# EAGLE design RTC (EAGLE 7.3.0)
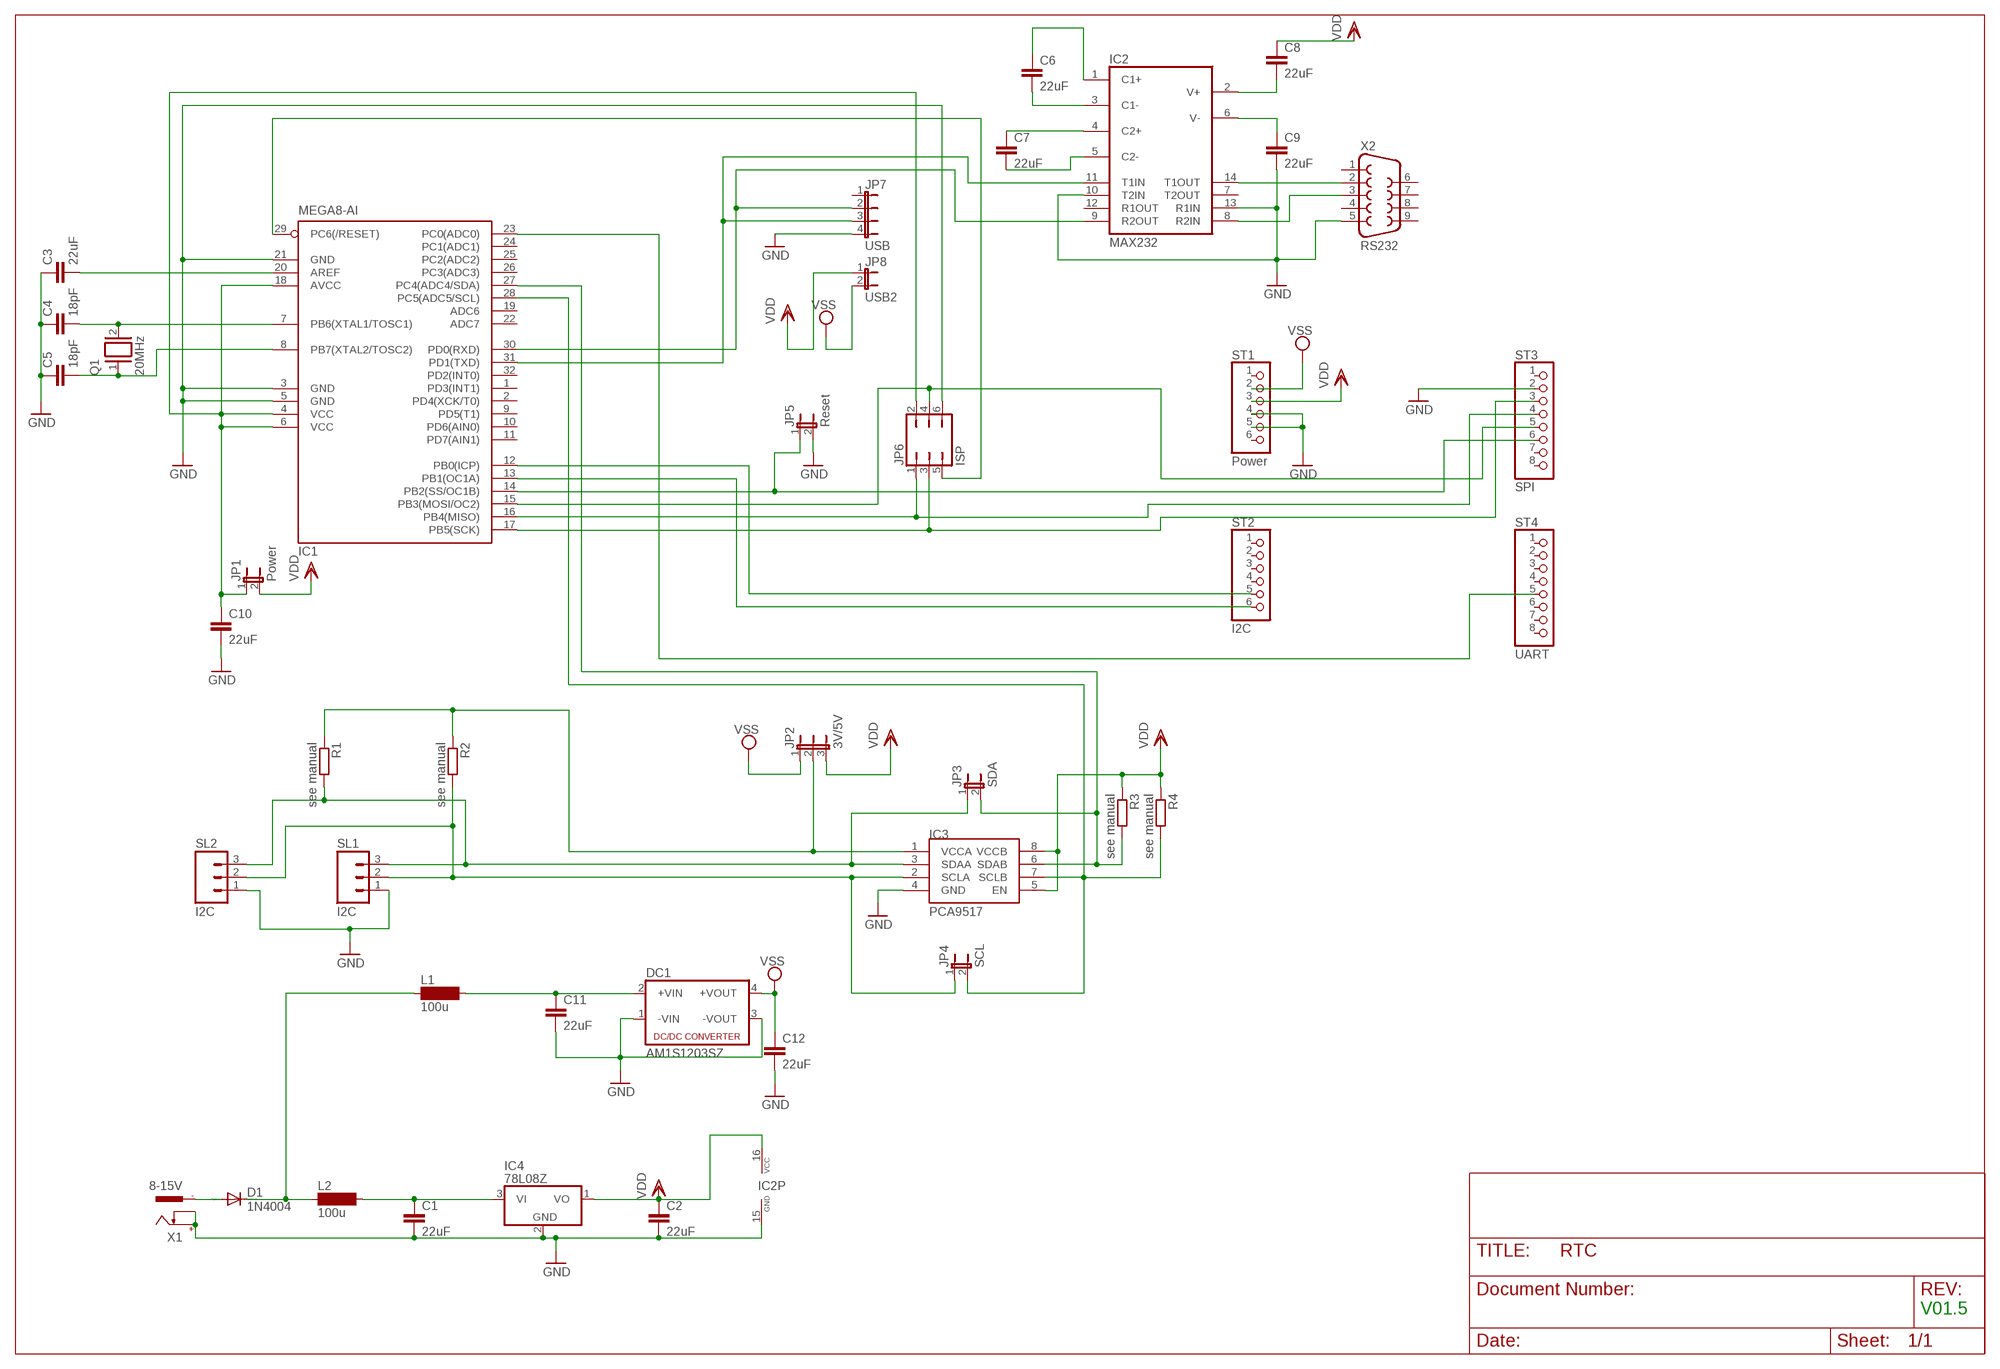
[diagram p0: schematic, sheet 1]

## Parts
C1  22uF  C-EUC1206  [C1206]
C2  22uF  C-EUC1206  [C1206]
C3  22uF  C-EUC1206  [C1206]
C4  18pF  C-EU025-025X050  [C025-025X050]
C5  18pF  C-EU025-025X050  [C025-025X050]
C6  22uF  C-EUC1206  [C1206]
C7  22uF  C-EUC1206  [C1206]
C8  22uF  C-EUC1206  [C1206]
C9  22uF  C-EUC1206  [C1206]
C10  22uF  C-EUC1206  [C1206]
C11  22uF  C-EUC1206  [C1206]
C12  22uF  C-EUC1206  [C1206]
D1  1N4004  [DO41-10]
DC1  AM1S1203SZ  NME  [NME]
IC1  MEGA8-AI  [TQFP32-08]
IC2  MAX232  [DIL16]
IC3  PCA9517  [SO-08]
IC4  78L08Z  [TO92]
JP1  Power  JP1E  [JP1]
JP2  3V/5V  JP2E  [JP2]
JP3  SDA  JP1E  [JP1]
JP4  SCL  JP1E  [JP1]
JP5  Reset  JP1E  [JP1]
JP6  ISP  JP3Q  [JP3Q]
JP7  USB  JP4E  [JP4]
JP8  USB2  JP1E  [JP1]
L1  100u  MS85  [MS85]
L2  100u  MS85  [MS85]
Q1  20MHz  XTAL/S  [QS]
R1  see manual  R-EU_R1206  [R1206]
R2  see manual  R-EU_R1206  [R1206]
R3  see manual  R-EU_R1206  [R1206]
R4  see manual  R-EU_R1206  [R1206]
SL1  I2C  M03  [03P]
SL2  I2C  M03  [03P]
ST1  Power  PINHD-1X6  [1X06]
ST2  I2C  PINHD-1X6  [1X06]
ST3  SPI  PINHD-1X8  [1X08]
ST4  UART  PINHD-1X8  [1X08]
X1  8-15V  737992-55  [737992-5]
X2  RS232  F09H  [F09H]

## Nets
GND: C1.2 C2.2 C3.1 C4.1 C5.1 C9.2 C10.2 C11.2 C12.2 DC1.1(-VIN) DC1.3(-VOUT) IC1.3(GND) IC1.5(GND) IC1.21(GND) IC2.10(T2IN) IC2.13(R1IN) IC2.15(GND) IC3.4(GND) IC4.2(GND) JP5.2 JP6.6 JP7.4 SL1.1 SL2.1 ST1.4 ST1.5 ST3.2 X1.+ X1.K X2.5
N$1: IC1.23(PC0(ADC0)) ST4.5
N$2: IC1.12(PB0(ICP)) ST2.5
N$3: C11.1 DC1.2(+VIN) L1.2
N$4: IC1.14(PB2(SS/OC1B)) JP5.1 ST3.6
N$5: IC1.27(PC4(ADC4/SDA)) IC3.6(SDAB) JP3.2 R3.2
N$6: IC2.8(R2IN) X2.3
N$7: D1.C L1.1 L2.1
N$8: IC1.31(PD1(TXD)) IC2.11(T1IN) JP7.3
N$9: IC1.30(PD0(RXD)) IC2.9(R2OUT) JP7.2
N$10: IC1.13(PB1(OC1A)) ST2.6
N$11: IC3.2(SCLA) JP4.1 R2.2 SL1.2 SL2.2
N$12: IC3.3(SDAA) JP3.1 R1.2 SL1.3 SL2.3
N$13: IC2.14(T1OUT) X2.2
N$14: C8.2 IC2.2(V+)
N$15: IC1.16(PB4(MISO)) JP6.1 ST3.4
N$16: C9.1 IC2.6(V-)
N$18: IC1.29(PC6(/RESET)) JP6.5
N$19: C4.2 IC1.7(PB6(XTAL1/TOSC1)) Q1.2
N$20: IC1.17(PB5(SCK)) JP6.3 ST3.3
N$21: IC3.1(VCCA) JP2.2 R1.1 R2.1
N$22: IC1.28(PC5(ADC5/SCL)) IC3.7(SCLB) JP4.2 R4.2
N$23: C6.1 IC2.1(C1+)
N$24: C6.2 IC2.3(C1-)
N$25: C7.1 IC2.4(C2+)
N$26: C7.2 IC2.5(C2-)
N$27: D1.A X1.-1
N$28: IC1.15(PB3(MOSI/OC2)) JP6.4 ST3.5
N$33: C1.1 IC4.3(VI) L2.2
N$35: C3.2 IC1.20(AREF)
N$37: C5.2 IC1.8(PB7(XTAL2/TOSC2)) Q1.1
N$44: C10.1 IC1.4(VCC) IC1.6(VCC) IC1.18(AVCC) JP1.1 JP6.2
VDD: C2.1 C8.1 IC2.16(VCC) IC3.5(EN) IC3.8(VCCB) IC4.1(VO) JP1.2 JP2.3 JP8.1 R3.1 R4.1 ST1.3
VSS: C12.1 DC1.4(+VOUT) JP2.1 JP8.2 ST1.2
Unconnected: IC1.1(PD3(INT1)) IC1.2(PD4(XCK/T0)) IC1.9(PD5(T1)) IC1.10(PD6(AIN0)) IC1.11(PD7(AIN1)) IC1.19(ADC6) IC1.22(ADC7) IC1.24(PC1(ADC1)) IC1.25(PC2(ADC2)) IC1.26(PC3(ADC3)) IC1.32(PD2(INT0)) IC2.7(T2OUT) IC2.12(R1OUT) JP7.1 ST1.1 ST1.6 ST2.1 ST2.2 ST2.3 ST2.4 ST3.1 ST3.7 ST3.8 ST4.1 ST4.2 ST4.3 ST4.4 ST4.6 ST4.7 ST4.8 X1.-2 X2.1 X2.4 X2.6 X2.7 X2.8 X2.9

## Notes on the sheet
- V01.5

## Library data of the parts
C1-C3 C6-C12 = rcl:C-EU: CAPACITOR, European symbol
C4 C5 = resistor:C-EU: CAPACITOR, European symbol
D1 = diode:1N4004: DIODE general purpose rectifier, 1 A
DC1 = dc-dc-converter:NME: DC-DC CONVERTER; MF: C & D TECHNOLOGIES, INC; MPN: NME1205D; OC_FARNELL: 1021466; OC_NEWARK: 98B8198
IC1 = atmel:MEGA8: MICROCONTROLLER 8 Kbytes FLASH, 1 kbytes SRAM, 512 bytes EEPROM, USART, 6-channel 10 bit ADC, 2-channel 8 bit ADC Pin compatible with Atmega48, ATMega88, ATMega168 Source: avr.lbr; MPN: ATMEGA8-16AU; OC_FARNELL: 9171371; OC_NEWARK: 73M8863
IC2 = maxim:MAX232: RS232 TRANSCEIVER; MF: MAXIM; MPN: MAX232ACPE+; OC_FARNELL: 9723773; OC_NEWARK: 68K4544
IC3 = PCA9517:PCA9517: PCA9517
IC4 = linear:78*: Positive VOLTAGE REGULATOR Source: http://cache.national.com/ds/LM/LM78L05.pdf http://www.fairchildsemi.com/ds/LM/LM7805.pdf
JP1 JP3-JP5 JP8 = jumper:JP1E: JUMPER
JP2 = jumper:JP2E: JUMPER
JP6 = jumper:JP3Q: JUMPER
JP7 = jumper:JP4E: JUMPER
L1 L2 = inductor-neosid:MS85: INDUCTOR SMD power inductor; OC_FARNELL: unknown; OC_NEWARK: unknown
Q1 = special:XTAL/S: CRYSTAL
R1-R4 = resistor:R-EU_: RESISTOR, European symbol
SL1 SL2 = con-amp-quick:M03: AMP QUICK CONNECTOR; OC_FARNELL: unknown; OC_NEWARK: unknown
ST1 ST2 = pinhead:PINHD-1X6: PIN HEADER
ST3 ST4 = pinhead:PINHD-1X8: PIN HEADER
X1 = con-conrad:737992-55: FEMALE PRINT CONNECTOR DIN 45323 (34V/3A), ROKA, distributor Conrad
X2 = con-subd:F09: SUB-D; OC_FARNELL: unknown; OC_NEWARK: unknown

## Board
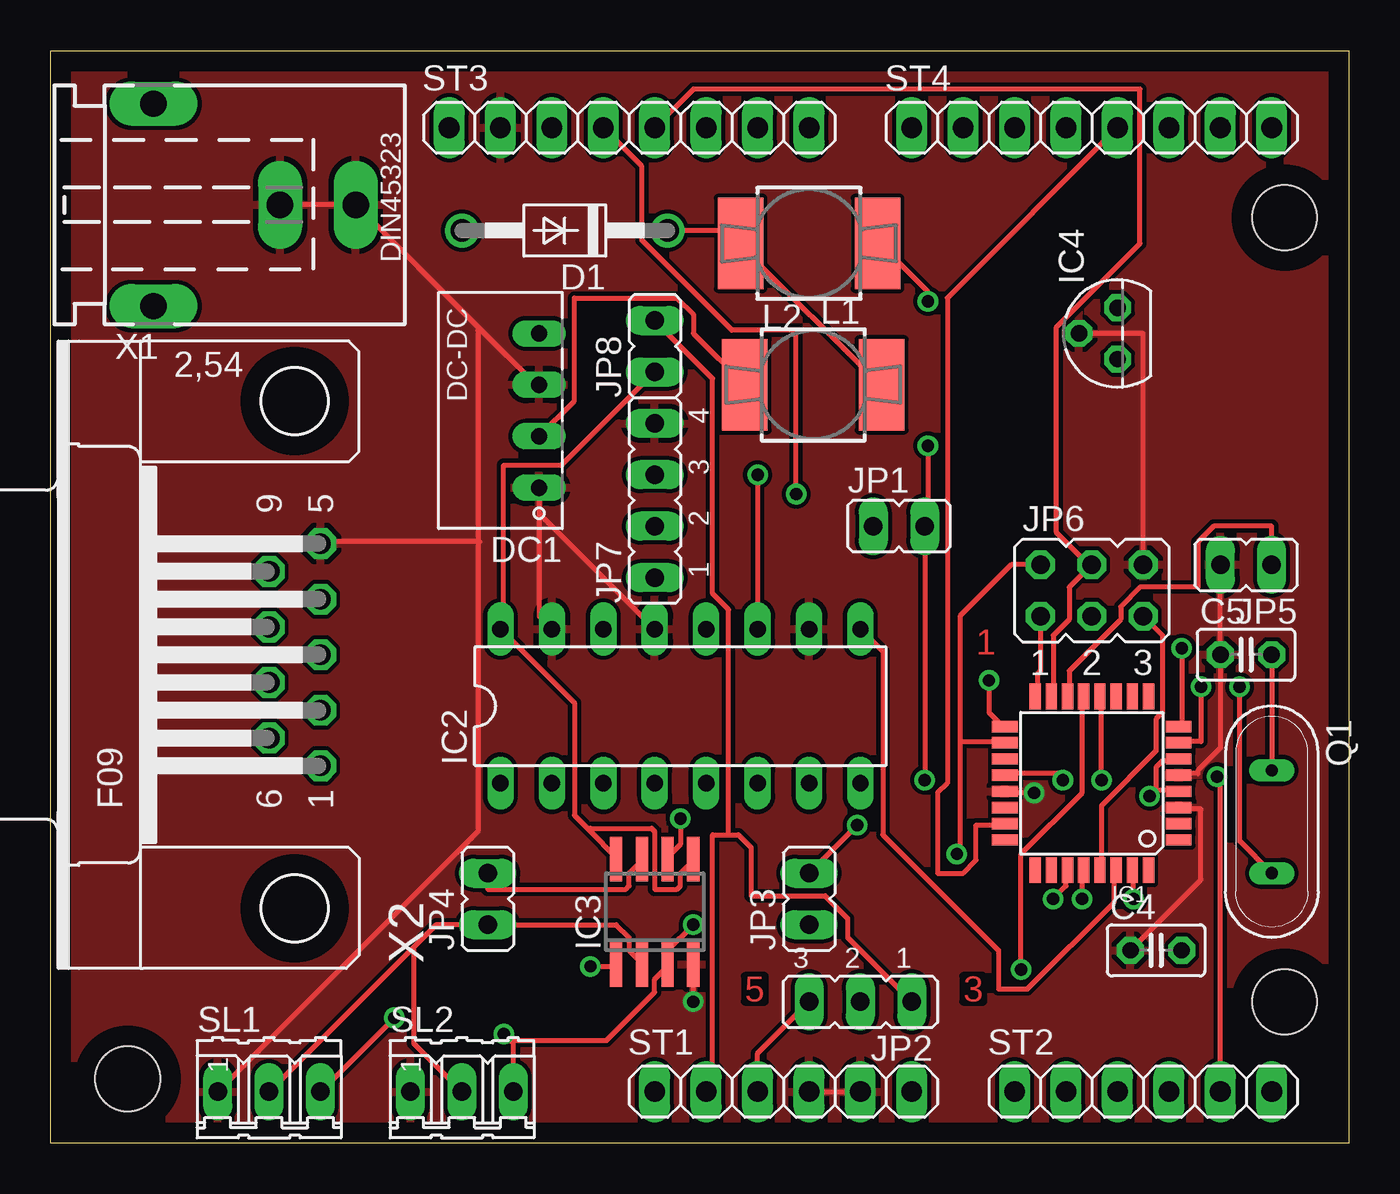
[diagram p1: board, top side]
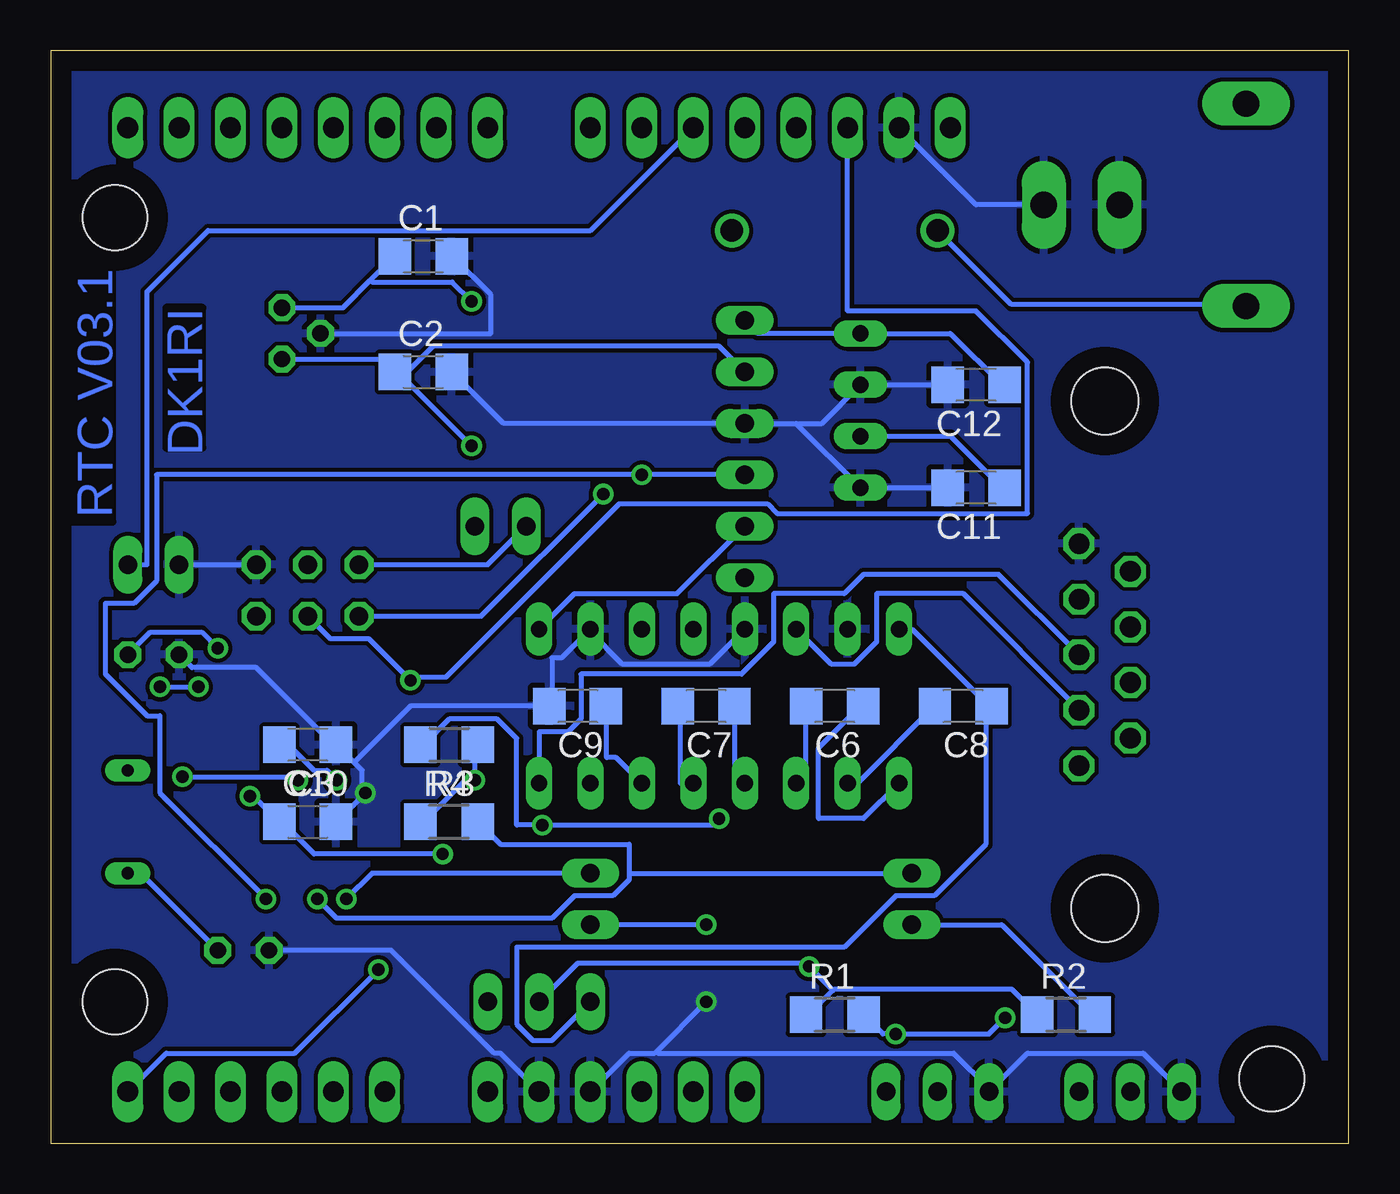
[diagram p2: board, bottom side, seen from below]

Size 64.14 x 53.98 mm. Coordinates in mm from the lower left corner, seen from the top.
Outline: 0,0 0,53.98 64.14,53.98 64.14,0 0,0
Copper layers (1*16): Top 0.035mm / dielectric 1.5mm / Bottom 0.035mm
Design rules "default": minimum track width 10mil, minimum drill 24mil, track to track 8mil, track to pad 8mil, pad to pad 8mil, via to via 8mil, smd to smd 8mil, copper to edge 40mil, drill to drill 8mil, minimum pad ring 10mil, minimum via ring 8mil, stop-mask expansion 4mil, vias tented up to drill 0mil, thermal gap 10mil
Holes 3.2 mm at 60.96,45.72 60.96,6.99 3.81,3.17

### Footprints (pad centres in the part's own frame; a part is rotated, then mirrored left to right if it is on the bottom)
C1206 = smd 1.6 x 1.8: 1 -1.4,0; 2 1.4,0
C025-025X050 = drill 0.813 octagon: 1 -1.27,0; 2 1.27,0
DO41-10 = drill 1.118: A 5.08,0; C -5.08,0
NME = drill 0.813 long: 1 0,3.81; 2 0,1.27; 3 0,-1.27; 4 0,-3.81
TQFP32-08 = smd 1.27 x 0.559: 1 -4.293,2.8; 2 -4.293,2; 3 -4.293,1.2; 4 -4.293,0.4; 5 -4.293,-0.4; 6 -4.293,-1.2; 7 -4.293,-2; 8 -4.293,-2.8; 17 4.293,-2.8; 18 4.293,-2; 19 4.293,-1.2; 20 4.293,-0.4; 21 4.293,0.4; 22 4.293,1.2; 23 4.293,2; 24 4.293,2.8 | smd 0.559 x 1.27: 9 -2.8,-4.293; 10 -2,-4.293; 11 -1.2,-4.293; 12 -0.4,-4.293; 13 0.4,-4.293; 14 1.2,-4.293; 15 2,-4.293; 16 2.8,-4.293; 25 2.8,4.293; 26 2,4.293; 27 1.2,4.293; 28 0.4,4.293; 29 -0.4,4.293; 30 -1.2,4.293; 31 -2,4.293; 32 -2.8,4.293
DIL16 = drill 0.813 long: 1 -8.89,-3.81; 2 -6.35,-3.81; 3 -3.81,-3.81; 4 -1.27,-3.81; 5 1.27,-3.81; 6 3.81,-3.81; 7 6.35,-3.81; 8 8.89,-3.81; 9 8.89,3.81; 10 6.35,3.81; 11 3.81,3.81; 12 1.27,3.81; 13 -1.27,3.81; 14 -3.81,3.81; 15 -6.35,3.81; 16 -8.89,3.81
SO-08 = smd 0.6 x 2.2: 1 -1.905,-2.6; 2 -0.635,-2.6; 3 0.635,-2.6; 4 1.905,-2.6; 5 1.905,2.6; 6 0.635,2.6; 7 -0.635,2.6; 8 -1.905,2.6
TO92 = drill 0.813 octagon: 1 -1.27,0; 2 0,1.905; 3 1.27,0
JP1 = drill 0.914 long: 1 0,-1.27; 2 0,1.27
JP2 = drill 0.914 long: 1 -2.54,0; 2 0,0; 3 2.54,0
JP3Q = drill 0.914 octagon: 1 -2.54,-1.27; 2 -2.54,1.27; 3 0,-1.27; 4 0,1.27; 5 2.54,-1.27; 6 2.54,1.27
JP4 = drill 0.914 long: 1 -3.81,0; 2 -1.27,0; 3 1.27,0; 4 3.81,0
MS85 = smd 4.5 x 2.25: 1 0,-3.383; 2 0,3.383
QS = drill 0.61 long: 1 -2.54,0; 2 2.54,0
R1206 = smd 1.6 x 1.803: 1 -1.422,0; 2 1.422,0
03P = drill 0.914 long: 1 -2.54,0; 2 0,0; 3 2.54,0
1X06 = drill 1.016 long: 1 -6.35,0; 2 -3.81,0; 3 -1.27,0; 4 1.27,0; 5 3.81,0; 6 6.35,0
1X08 = drill 1.016 long: 1 -8.89,0; 2 -6.35,0; 3 -3.81,0; 4 -1.27,0; 5 1.27,0; 6 3.81,0; 7 6.35,0; 8 8.89,0
737992-5 = drill 1.3 pad 2.184 long: + 0,10; -1 5,0; -2 -5,0; K 0,6.25
F09H = drill 1.016 octagon: 1 -5.486,-1.27; 2 -2.743,-1.27; 3 0,-1.27; 4 2.743,-1.27; 5 5.486,-1.27; 6 -4.115,1.27; 7 -1.372,1.27; 8 1.372,1.27; 9 4.115,1.27 | hole 3.302: -12.522,0; 12.522,0

### Placement (x,y rotation side)
C1  45.72,43.81 0 bottom
C2  45.72,38.1 0 bottom
C3  51.43,19.68 180 bottom
C4  54.61,9.53 0 top
C5  59.05,24.13 0 top
C6  25.4,21.59 180 bottom
C7  31.75,21.59 180 bottom
C8  19.05,21.59 180 bottom
C9  38.1,21.59 180 bottom
C10  51.43,15.88 0 bottom
C11  18.42,32.38 180 bottom
C12  18.42,37.47 180 bottom
D1  25.4,45.09 180 top
DC1  24.13,36.2 180 top
IC1  51.43,17.78 180 top
IC2  31.12,21.59 0 top
IC3  29.85,11.43 0 top
IC4  52.7,40.01 90 top
JP1  41.91,30.48 270 top
JP2  40,6.99 180 top
JP3  37.46,12.06 0 top
JP4  21.59,12.06 0 top
JP5  59.05,28.57 90 top
JP6  51.43,27.3 0 top
JP7  29.85,31.75 90 top
JP8  29.85,39.37 0 top
L1  37.67,37.47 90 top
L2  37.46,44.45 270 top
Q1  60.32,15.88 270 top
R1  25.4,6.35 0 bottom
R2  13.97,6.35 0 bottom
R3  44.45,19.68 180 bottom
R4  44.45,15.88 0 bottom
SL1  10.79,2.54 0 top
SL2  20.32,2.54 0 top
ST1  36.2,2.54 0 top
ST2  53.98,2.54 0 top
ST3  28.58,50.16 0 top
ST4  51.43,50.16 0 top
X1  5.08,46.35 270 top
X2  12.06,24.13 90 top

### Tracks (layer width: path | path; a pad name or v marks a point on that pad's centre or on a via)
GND  (via drill 0.61)
  Top 0.254: C4.1 56.83,13.02 56.83,16.51 55.88,16.51 IC1.3 | v31.75,6.99 IC3.4 | ST1.4 ST1.5 | IC1.5 55.88,18.26 56.67,18.26 56.67,18.41 57.78,19.53 C5.1 JP5.2 | IC4.2 53.98,40.01 JP6.6 | v48.58,17.3 47.15,17.3 IC1.21 | X1.K X1.+ 21.19,40.24 | IC2.15 24.13,26.04 24.13,31.11 | DC1.1 24.13,31.11 | 24.13,31.11 IC2.13 | 21.19,40.24 23.97,37.47 DC1.3 | SL1.1 21.11,15.4 21.11,29.72 | 21.11,29.72 21.11,40.16 21.19,40.24 | 21.11,29.72 13.44,29.72 X2.5 | 21.21,29.72 21.11,29.72
  Bottom 0.254: SL1.1 10.16,4.45 15.88,4.45 SL2.1 17.78,2.7 19.53,4.45 34.13,4.45 34.21,4.52 | 34.21,4.52 34.29,4.45 35.56,4.45 ST1.4 | 34.21,4.52 v31.75,6.99 | C4.1 47.31,9.53 42.23,4.45 41.91,4.45 ST1.5 | IC4.2 42.39,40.01 42.39,41.91 44.29,43.81 C1.2 | JP5.2 JP6.6 | C10.2 50.01,15.88 v48.58,17.3 48.74,17.3 48.74,18.41 49.13,18.81 | 49.13,18.81 50.01,19.68 C3.1 50.16,19.68 53.98,23.5 57.15,23.5 C5.1 | 49.13,18.81 46.35,21.59 C9.2 39.37,21.59 39.37,23.97 38.89,23.97 IC2.10 37.46,25.24 35.88,23.65 31.59,23.65 IC2.13 | ST3.2 18.42,46.35 X1.+ | C11.2 DC1.1 27.31,35.56 | C12.2 DC1.3 26.04,35.56 27.31,35.56 | C2.2 44.29,38.1 41.75,35.56 JP7.4 27.31,35.56
  pour Top: 0.64,53.34 63.5,53.34 63.5,1.27 63.5,0.64 0.64,0.64
  pour Bottom: 0.64,53.34 63.5,53.34 63.5,0.64 0.64,0.64
N$1
  Top 0.254: ST4.5 44.29,41.75 44.29,17.78 43.81,17.3 43.81,13.34 45.09,13.34 45.72,13.97 45.72,15.72 46.99,15.72 IC1.23
N$2  (via drill 0.61)
  Top 0.254: v51.91,17.94 51.91,22.07 IC1.12 | v57.63,18.1 57.78,17.94 ST2.5
  Bottom 0.254: v51.91,17.94 52.07,18.1 v57.63,18.1
N$3
  Top 0.254: L1.2 31.75,40.01 31.75,40.96 30.96,41.75 25.88,41.75 25.88,36.67 DC1.2
  Bottom 0.254: DC1.2 19.69,34.92 17.15,32.38 C11.1
N$4
  Top 0.254: JP5.1 60.32,30.48 57.47,30.48 56.67,29.69 56.67,27.46 53.82,27.46 52.86,26.51 52.86,25.88 50.32,23.34 50.32,22.23 IC1.14
  Bottom 0.254: ST3.6 37.46,45.09 56.36,45.09 59.37,42.07 59.37,28.57 JP5.1
N$5  (via drill 0.61)
  Top 0.254: v49.53,12.06 50.16,12.7 50.16,13.34 IC1.27 | JP3.2 v39.85,15.72 | v31.12,16.03 31.12,14.76 30.48,14.13 IC3.6
  Bottom 0.254: v49.53,12.06 48.26,13.34 JP3.2 | R3.2 45.72,19.68 44.45,20.95 42.07,20.95 41.12,20 41.12,15.72 v39.85,15.72 31.43,15.72 v31.12,16.03
N$6
  Bottom 0.254: IC2.8 40,20.32 38.58,20.32 37.94,20.95 37.94,23.18 30,23.18 28.42,24.77 28.42,27.15 24.92,27.15 23.97,28.1 17.3,28.1 X2.3
N$7
  Top 0.254: D1.C 33.97,45.09 33.97,44.45 L2.1 34.13,44.45 34.13,44.29 40.96,37.47 L1.1
N$8  (via drill 0.61)
  Top 0.254: v53.5,12.06 53.5,13.34 IC1.31 | v34.92,33.02 IC2.11
  Bottom 0.254: v53.5,12.06 58.74,17.3 58.74,21.11 59.37,21.11 61.44,23.18 61.44,26.67 60.01,26.67 58.9,27.78 58.9,33.02 v34.92,33.02 JP7.3
N$9
  Top 0.254: IC2.9 41.12,24.29 41.12,15.24 46.83,9.53 46.83,7.62 48.26,7.62 52.55,11.91 52.55,13.34 IC1.30
  Bottom 0.254: JP7.2 33.18,27.15 38.26,27.15 IC2.9
N$10  (via drill 0.61)
  Top 0.254: v47.94,8.57 47.94,14.29 50.96,17.3 50.96,22.07 IC1.13
  Bottom 0.254: v47.94,8.57 52.07,4.45 58.42,4.45 ST2.6
N$11
  Top 0.254: IC3.2 29.21,8.89 28.58,9.53 28.58,10.16 27.94,10.79 JP4.1 19.05,10.79 17.86,9.6 | 17.86,9.6 SL1.2 | SL2.2 17.94,4.92 17.94,9.53 17.86,9.6
  Bottom 0.254: JP4.1 17.15,10.79 12.7,6.35 R2.2
N$12  (via drill 0.61)
  Top 0.254: 22.78,5 22.86,4.92 SL2.3 | 22.78,5 v22.38,5.4 | 22.78,5 22.86,5.08 27.46,5.08 29.85,7.46 29.85,8.1 30.48,8.73 IC3.3 30.48,9.53 v31.75,10.79 | v16.99,6.19 SL1.3
  Bottom 0.254: R1.2 23.02,5.4 v22.38,5.4 17.78,5.4 v16.99,6.19 | v31.75,10.79 JP3.1
N$13
  Bottom 0.254: IC2.14 25.56,23.65 24.45,23.65 23.34,24.77 23.34,27.15 19.05,27.15 13.33,21.43 X2.2
N$14
  Bottom 0.254: IC2.2 24.29,17.78 20.48,21.59 C8.2
N$15  (via drill 0.61)
  Top 0.254: JP6.1 48.89,23.34 48.74,23.18 48.74,22.23 IC1.16 | ST3.4 29.21,48.26 29.21,44.61 33.66,40.16 36.83,40.16 v36.83,32.07
  Bottom 0.254: v36.83,32.07 42.86,26.04 JP6.1
N$16
  Bottom 0.254: IC2.6 36.2,19.05 36.67,19.05 36.67,21.59 C9.1
N$18
  Top 0.254: JP6.5 54.93,25.08 54.93,21.27 54.61,20.95 54.61,19.37 51.91,16.67 51.91,13.49 IC1.29
N$19  (via drill 0.61)
  Top 0.254: v56.83,22.54 56.83,19.84 55.88,19.84 IC1.7 | v58.74,22.54 58.74,14.92 Q1.2
  Bottom 0.254: v58.74,22.54 v56.83,22.54 | C4.2 59.69,13.34 Q1.2
N$20  (via drill 0.61)
  Top 0.254: v46.35,22.86 46.35,21.27 46.99,20.64 IC1.17
  Bottom 0.254: JP6.3 50.32,24.92 48.42,24.92 v46.35,22.86 46.35,23.02 44.61,23.02 36.04,31.59 28.73,31.59 28.26,31.11 15.88,31.11 15.88,38.58 18.42,41.12 24.77,41.12 ST3.3
N$21  (via drill 0.61)
  Top 0.254: v26.67,8.73 27.94,8.73 IC3.1
  Bottom 0.254: 25.48,7.54 26.67,6.35 R1.1 | 25.48,7.54 25.4,7.62 16.67,7.62 R2.1 | 25.48,7.54 v26.67,8.73 26.83,8.89 38.1,8.89 JP2.2
N$22  (via drill 0.61)
  Top 0.254: JP4.2 21.59,12.54 28.42,12.54 28.58,12.7 28.58,13.34 29.21,13.97 IC3.7 | v50.96,12.06 50.96,13.34 IC1.28
  Bottom 0.254: v50.96,12.06 50.01,11.11 39.37,11.11 38.26,12.22 36.35,12.22 35.56,13.02 35.56,13.34 | 35.56,13.34 35.56,14.76 41.91,14.76 R4.2 | 35.56,13.34 JP4.2
N$23
  Bottom 0.254: IC2.1 23.97,16.03 26.19,16.03 26.19,19.53 24.13,21.59 C6.1
N$24
  Bottom 0.254: IC2.3 26.83,17.78 26.83,21.59 C6.2
N$25
  Bottom 0.254: IC2.4 30.32,17.78 30.32,21.59 C7.1
N$26
  Bottom 0.254: IC2.5 33.02,17.78 33.02,21.59 C7.2
N$27
  Bottom 0.254: D1.A 16.67,41.43 5.08,41.43 X1.-1
N$28
  Top 0.254: IC1.15 49.53,22.23 49.53,25.08 50.32,25.88 50.32,27.46 JP6.4 51.28,28.57 49.69,30.16 49.69,40.32 53.82,44.45 53.82,52.07 31.75,52.07 ST3.5
N$33  (via drill 0.61)
  Top 0.254: v43.34,41.59 43.34,42.07 40.96,44.45 L2.2
  Bottom 0.254: 48.34,42.62 49.69,41.27 IC4.3 | 48.34,42.62 47.15,43.81 C1.1 | v43.34,41.59 44.29,42.55 48.26,42.55 48.34,42.62
N$35  (via drill 0.61)
  Top 0.254: v50.01,17.94 50.01,18.26 47.15,18.26 IC1.20
  Bottom 0.254: v50.01,17.94 50.48,18.41 51.12,18.41 52.39,19.68 C3.2
N$37  (via drill 0.61)
  Top 0.254: v55.88,24.45 55.88,20.64 IC1.8 | C5.2 Q1.1
  Bottom 0.254: v55.88,24.45 56.67,25.24 59.21,25.24 C5.2
N$44  (via drill 0.61)
  Top 0.254: 54.61,17.46 55.72,17.46 IC1.4 | 54.61,17.46 54.61,18.57 54.93,18.89 55.72,18.89 IC1.6 | 54.61,17.46 v54.29,17.14 | 44.93,19.84 46.99,19.84 IC1.18 | 44.93,19.84 44.93,26.04 47.47,28.57 JP6.2 | v44.77,14.29 44.93,14.45 44.93,19.84
  Bottom 0.254: v54.29,17.14 54.13,17.14 52.86,15.88 C10.1 52.7,15.88 51.12,14.29 v44.77,14.29 | JP1.1 42.54,28.57 JP6.2
VDD  (via drill 0.61)
  Top 0.254: v43.34,34.45 43.34,30.64 JP1.2 v43.18,17.94 | JP2.3 34.92,4.45 ST1.3 | 26.59,15.48 25.88,16.19 25.88,21.75 IC2.16 22.38,25.4 22.38,33.5 25.24,33.5 JP8.1 | 26.59,15.48 27.94,14.13 IC3.8 | IC3.5 31.75,13.97 31.12,13.34 31.12,12.7 30.96,12.54 29.85,12.54 29.85,15.4 29.69,15.56 26.67,15.56 26.59,15.48
  Bottom 0.254: 43.42,18.18 43.18,18.41 43.18,19.68 R3.1 | 43.42,18.18 45.72,15.88 R4.1 | IC4.1 47.78,38.73 47.15,38.1 C2.1 | v43.34,34.45 46.99,38.1 C2.1 | v43.18,17.94 43.42,18.18 | IC2.16 21.59,25.4 17.78,21.59 C8.1 17.94,21.59 17.94,14.76 20.48,12.22 22.38,12.22 24.92,9.68 41.12,9.68 41.12,5.87 40.32,5.08 39.37,5.08 JP2.3 | JP8.1 31.12,39.37 45.24,39.37 46.67,37.94 C2.1
VSS
  Top 0.254: JP2.1 39.37,10.16 39.37,11.11 38.26,12.22 34.61,12.22 34.61,14.61 33.97,15.24 33.5,15.24 | 33.5,15.24 32.7,15.24 32.7,2.86 ST1.2 | JP8.2 32.7,37.78 32.7,27.15 33.5,26.35 33.5,15.24
  Bottom 0.254: C12.1 17.15,37.47 19.69,40.01 DC1.4 29.21,40.01 JP8.2

### Text on the board
Top: 1 | 5 | 3
Bottom: RTC V03.1 | DK1RI